# Altium schematic sheet ROV_PCB4.SchDoc
size A
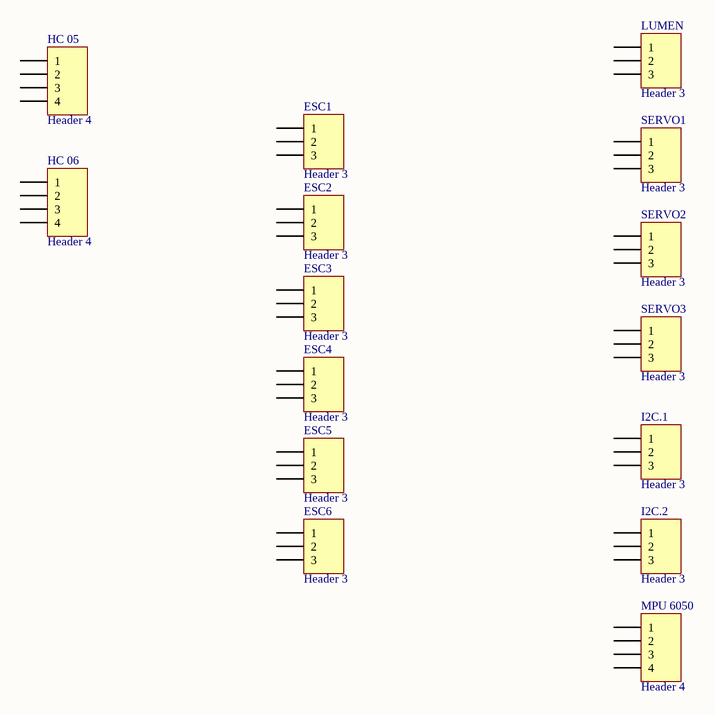
[diagram p0: ROV_PCB4.SchDoc]

## Parts
ESC1  Header 3  [HDR1X3]
ESC2  Header 3  [HDR1X3]
ESC3  Header 3  [HDR1X3]
ESC4  Header 3  [HDR1X3]
ESC5  Header 3  [HDR1X3]
ESC6  Header 3  [HDR1X3]
HC_05  Header 4  [HDR1X4]
HC_06  Header 4  [HDR1X4]
I2C.1  Header 3  [HDR1X3]
I2C.2  Header 3  [HDR1X3]
LUMEN  Header 3  [HDR1X3]
MPU_6050  Header 4  [HDR1X4]
SERVO1  Header 3  [HDR1X3]
SERVO2  Header 3  [HDR1X3]
SERVO3  Header 3  [HDR1X3]

## Nets

Not connected (* = marked no-connect by the designer): ESC1 1 2 3; ESC2 1 2 3; ESC3 1 2 3; ESC4 1 2 3; ESC5 1 2 3; ESC6 1 2 3; HC_05 1 2 3 4; HC_06 1 2 3 4; I2C.1 1 2 3; I2C.2 1 2 3; LUMEN 1 2 3; MPU_6050 1 2 3 4; SERVO1 1 2 3; SERVO2 1 2 3; SERVO3 1 2 3

## Library data of the parts
ESC1-ESC6 I2C.1 I2C.2 LUMEN SERVO1-SERVO3 = Header 3: Header, 3-Pin; LatestRevisionDate: 17-Jul-2002; LatestRevisionNote: Re-released for DXP Platform.; Publisher: Altium Limited
HC_05 HC_06 MPU_6050 = Header 4: Header, 4-Pin; LatestRevisionDate: 17-Jul-2002; LatestRevisionNote: Re-released for DXP Platform.; Publisher: Altium Limited